# EAGLE design TrinketBlinkM0 (EAGLE 8.4.2)
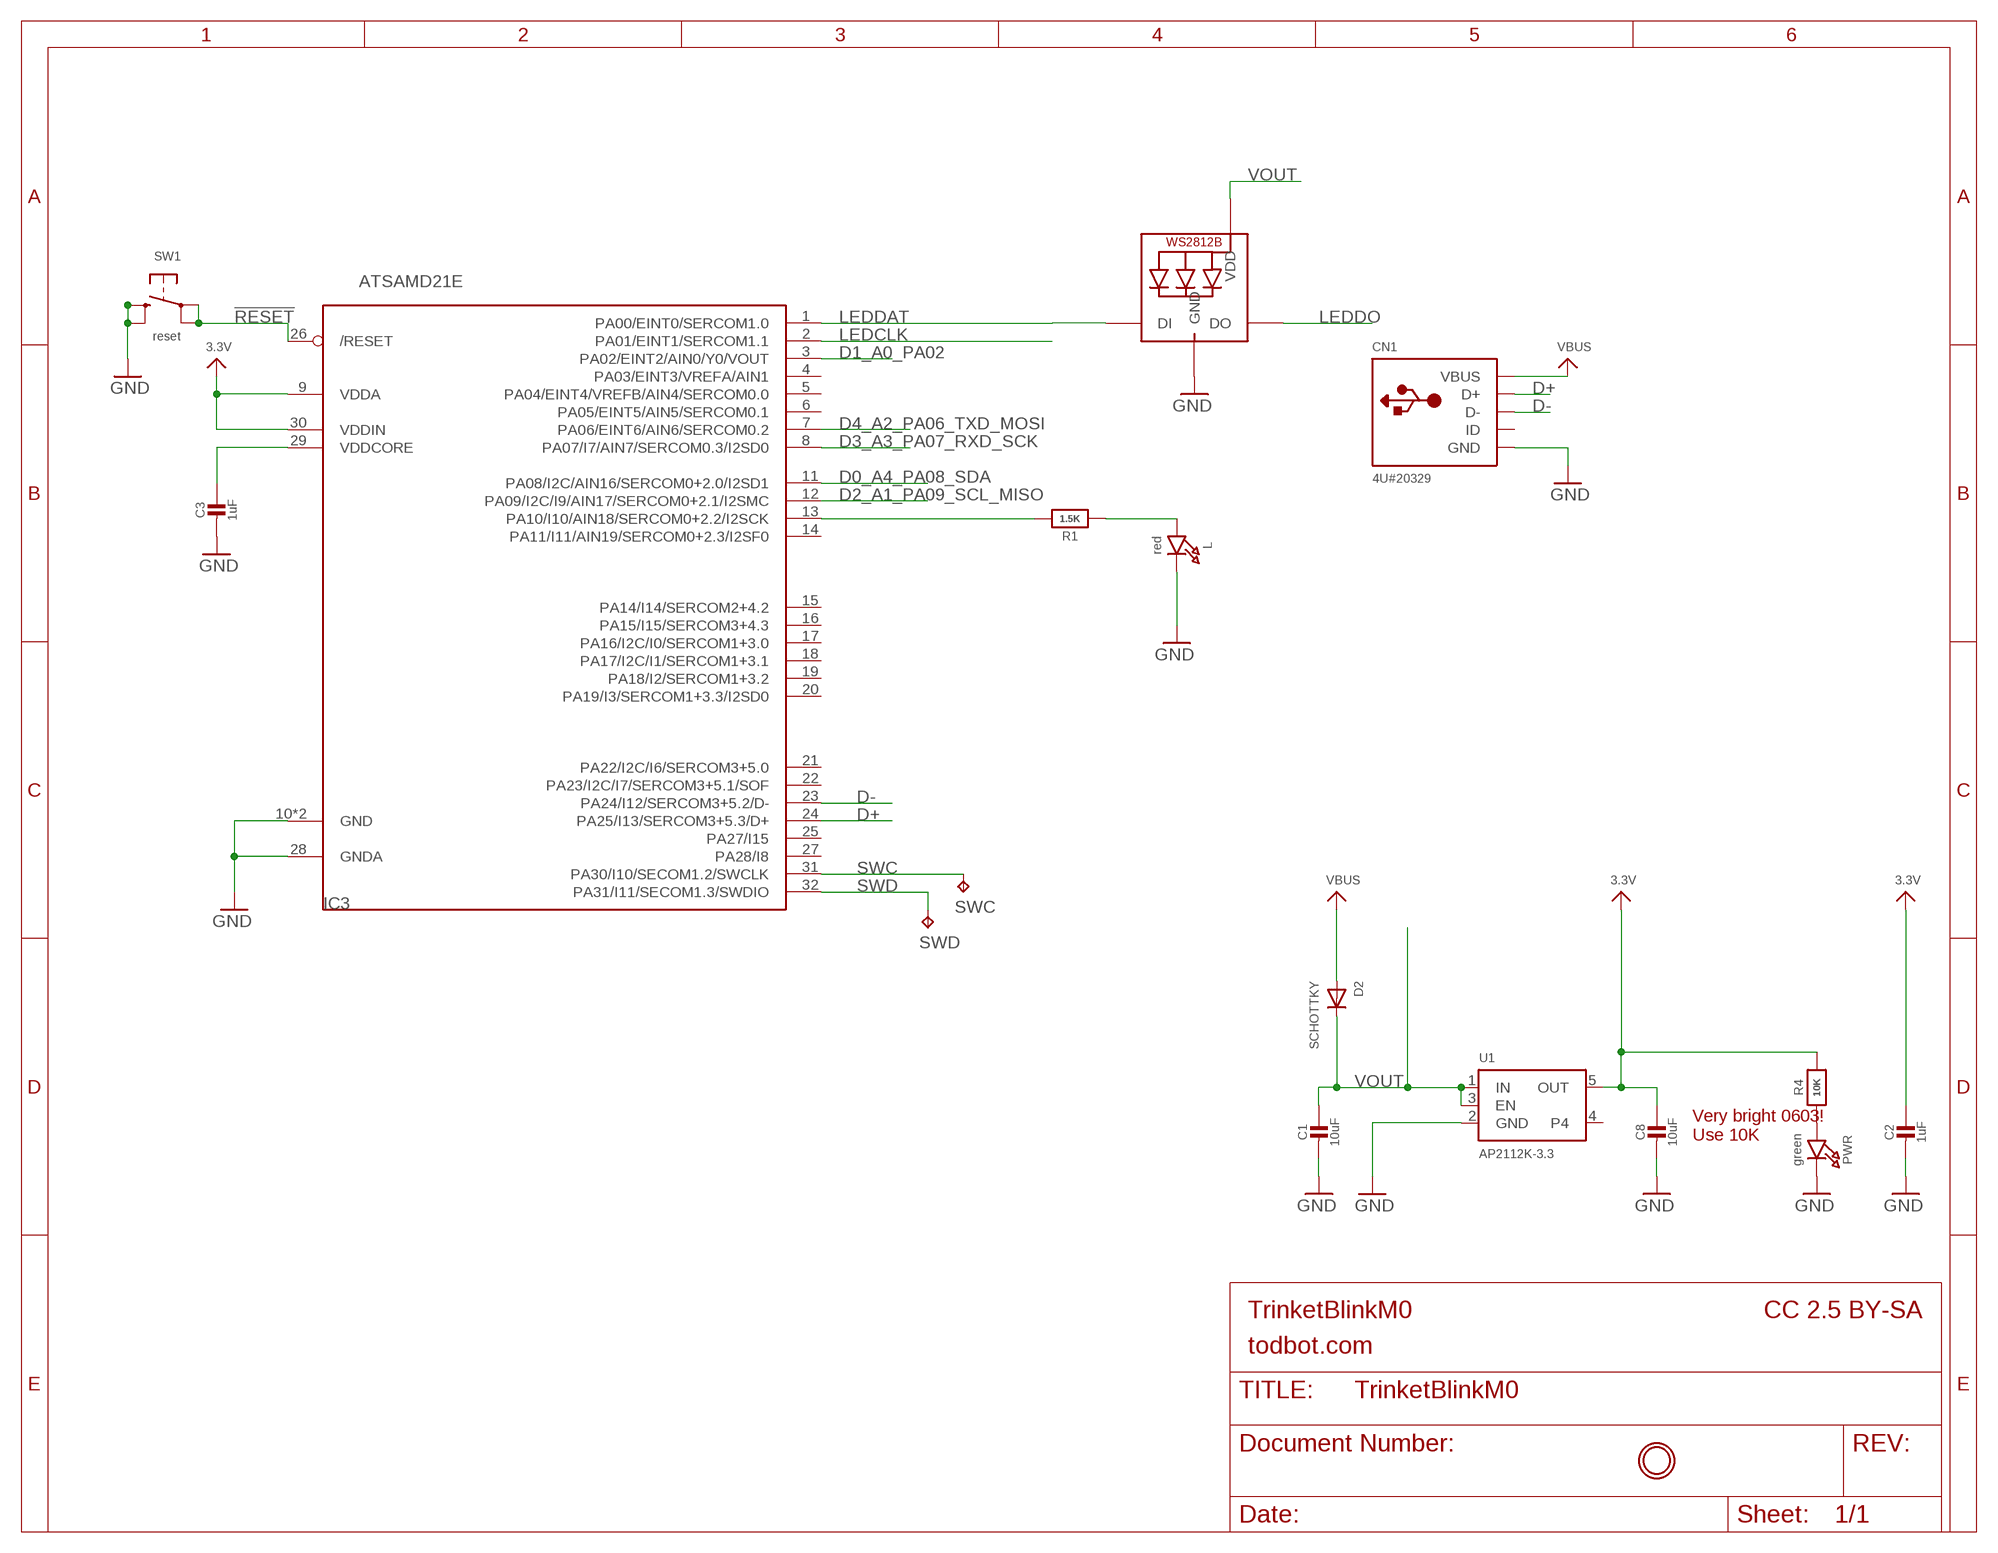
[diagram p0: schematic, sheet 1]

## Parts
C1  10uF  CAP_CERAMIC0805-NOOUTLINE  [0805-NO]
C2  1uF  CAP_CERAMIC0603_NO  [0603-NO]
C3  1uF  CAP_CERAMIC0603_NO  [0603-NO]
C8  10uF  CAP_CERAMIC0805-NOOUTLINE  [0805-NO]
CN1  4U#20329  USB_MICRO_20329_V2  [4UCONN_20329_V2]
D2  SCHOTTKY  DIODE_SOD-123FL  [SOD-123FL]
IC3  ATSAMD21E  [QFN32_5MM]
L  red  LED0603_NOOUTLINE  [CHIPLED_0603_NOOUTLINE]
LED1  WS2812B5050  [WS2812B]
PWR  green  LED0603_NOOUTLINE  [CHIPLED_0603_NOOUTLINE]
R1  1.5K  RESISTOR_0603_NOOUT  [0603-NO]
R4  10K  RESISTOR_0603_NOOUT  [0603-NO]
SW1  reset  SWITCH_TACT_SMT4.6X2.8  [BTN_KMR2_4.6X2.8]
SWC  TPB1,27  [B1,27]
SWD  TPB1,27  [B1,27]
U1  AP2112K-3.3  VREG_SOT23-5  [SOT23-5]
U$8  MOUNTINGHOLE2.0  [MOUNTINGHOLE_2.0_PLATED]

## Nets
3.3V: C2.1 C8.1 IC3.9(VDDA) IC3.30(VDDIN) R4.2 U1.5(OUT)
!RESET: IC3.26(/RESET) SW1.A'(P1) SW1.A(P)
D0_A4_PA08_SDA: IC3.11(PA08/I2C/AIN16/SERCOM0+2.0/I2SD1)
D1_A0_PA02: IC3.3(PA02/EINT2/AIN0/Y0/VOUT)
D2_A1_PA09_SCL_MISO: IC3.12(PA09/I2C/I9/AIN17/SERCOM0+2.1/I2SMC)
D3_A3_PA07_RXD_SCK: IC3.8(PA07/I7/AIN7/SERCOM0.3/I2SD0)
D4_A2_PA06_TXD_MOSI: IC3.7(PA06/EINT6/AIN6/SERCOM0.2)
D+: CN1.D+ IC3.24(PA25/I13/SERCOM3+5.3/D+)
D-: CN1.D- IC3.23(PA24/I12/SERCOM3+5.2/D-)
GND: C1.2 C2.2 C3.2 C8.2 CN1.BASE@1(GND) CN1.BASE@2(GND) CN1.GND CN1.SPRT@1(GND) CN1.SPRT@2(GND) CN1.SPRT@3(GND) CN1.SPRT@4(GND) IC3.10(GND) IC3.28(GNDA) IC3.33(GND) L.C LED1.3-GND(GND) PWR.C SW1.B'(S1) SW1.B(S) U1.2(GND)
LEDCLK: IC3.2(PA01/EINT1/SERCOM1.1)
LEDDAT: IC3.1(PA00/EINT0/SERCOM1.0) LED1.4-DIN(DI)
LEDDO: LED1.2-DOUT(DO)
N$1: L.A R1.1
N$2: IC3.13(PA10/I10/AIN18/SERCOM0+2.2/I2SCK) R1.2
N$6: PWR.A R4.1
SWC: IC3.31(PA30/I10/SECOM1.2/SWCLK) SWC.TP
SWD: IC3.32(PA31/I11/SECOM1.3/SWDIO) SWD.TP
VBUS: CN1.VBUS D2.A
VDDCORE: C3.1 IC3.29(VDDCORE)
VOUT: C1.1 D2.C LED1.1-VDD(VDD) U1.1(IN) U1.3(EN)
Unconnected: CN1.ID IC3.4(PA03/EINT3/VREFA/AIN1) IC3.5(PA04/EINT4/VREFB/AIN4/SERCOM0.0) IC3.6(PA05/EINT5/AIN5/SERCOM0.1) IC3.14(PA11/I11/AIN19/SERCOM0+2.3/I2SF0) IC3.15(PA14/I14/SERCOM2+4.2) IC3.16(PA15/I15/SERCOM3+4.3) IC3.17(PA16/I2C/I0/SERCOM1+3.0) IC3.18(PA17/I2C/I1/SERCOM1+3.1) IC3.19(PA18/I2/SERCOM1+3.2) IC3.20(PA19/I3/SERCOM1+3.3/I2SD0) IC3.21(PA22/I2C/I6/SERCOM3+5.0) IC3.22(PA23/I2C/I7/SERCOM3+5.1/SOF) IC3.25(PA27/I15) IC3.27(PA28/I8) U1.4

## Notes on the sheet
- Very bright 0603!
  Use 10K
- TrinketBlinkM0 | CC 2.5 BY-SA
- todbot.com

## Library data of the parts
C1-C3 C8 = microbuilder:CAP_CERAMIC: Ceramic Capacitors For new designs, use the packages preceded by an '_' character since they are more reliable: The following footprints should be used on most boards: _0402 - Standard footprint for regular board layouts _0603 - Standard footprint for regular board layouts _0805 - Standard footprint for regular board layouts _1206 - Standard footprint for regular board layouts For extremely tight-pitch boards where space is at a premium, the following 'micro-pitch' footprints can be used (smaller pads, no silkscreen outline, etc.): _0402MP - Micro-pitch footprint for very dense/compact boards _0603MP - Micro-pitch footprint for very dense/compact boards _0805MP - Micro-pitch footprint for very dense/compact boards _1206MP - Micro-pitch footprint for very dense/compact boards
CN1 = microbuilder:USB: USB Connectors USBMINIB - Surface Mount Female Mini-B USB Connector 4UConnector: 06564
D2 = adafruit:DIODE: Diode SMADIODE - SMA Surface Mount Package 20V 1A Schottky Diode Digikey: 641-1014-6-ND DO-1N4148 - Through Hole Small Current Diode SOD-123 20V 1 A (.5mV Vf) Schottky Diode - Digikey: MBRX120TPMSCT-ND SOD-323 10V 570mA (.38mV Vf, 3ns) Schottky Diode - Digikey: ZLLS410CT-ND SOD-523 30V 30mA Schottky Diode (RB751S-40TE61) - Digikey: RB751S-40TE61CT-ND SOT23-R/W - SOT23 Package (R = Solder Paste/Reflow Ovens, W = Hand-Soldering) BAT54Film 40V 300mA - Digikey: 497-7162-1-ND
IC3 = microbuilder:ATSAMD21E
L PWR = microbuilder:LED: LED 0603 - 0603 Surface Mount Package 2mA: Green LED - Low Power (3.9mcd, 2ma, 1.7Vf) - Digikey: 475-2709-2-ND Orange LED - Low Power (9.8mcd, 2ma, 1.8Vf) - Digikey: 475-1194-2-ND Red LED - Low Power (5mcd, 2ma, 1.8Vf) - Digikey: 475-1195-2-ND Yellow LED - Low Power (7mcd, 2ma, 1.8Vf) - Digikey: 475-1196-2-ND 5mA: Blue LED - Low Power (17mcd, 5ma, 2.9Vf) - Digikey: LNJ937W8CRACT-ND 0805 - 0805 Surface Mount Package 2mA: Red LED (8.8mcd, 2mA, 1.8Vf, Clear) - Low Power [Digikey: 475-2510-1-ND] Green LED (5mcd, 2mA, 1.8Vf, Clear) - Low Power [Digikey: 475-2730-1-ND] Yellow LED (11.3mcd, 2mA, 1.8Vf, Clear) - Low Power [Digikey: 475-2555-1-ND] 20mA: Red LED (104mcd, 20mA, Diffused) - LS R976 [Digikey: 475-1278-6-ND] Red LED (12mcd, 20mA, 2.0Vf, Clear) - APT2012EC [Digikey: 754-1128-1-ND] Green LED (15mcd, 20mA, 2.2Vf, Clear) - APT2012GC [Digikey: 754-1131-1-ND] Orange LED (160mcd, 20mA, 2.1Vf, Clear) - APT2012SECK [Digikey: 754-1130-1-ND] 1206 - 1206 Surface Mount Package Green LED (26mcd, 20mA, Diffused) - LG N971 [Digikey: 475-1407-6-ND] Red LED (15mcd, 20mA, Diffused) - LH N974 [Digikey: 475-1416-6-ND] Cree - Cree High-Power Surface Mount LEDs XPEBWT-L1-0000-00D50 - White 111lm 350mA 2.9Vf 6200K 110° XTEAWT-00-0000-00000LEE3 - White 114lm 350mA 2.85Vf 5000K 115° Everlight - Everlight 45-21 Series Surface Mount LEDs 45-21/QK2C-B2832AC2CB2/2T - Warm White 2000mcd 20mA 3.25Vf 3050K 120° 45-21/LK2C-B38452C4CB2/2T - Nuetral White 2000mcd 20mA 3.25Vf 4150K 120° 45-21/LK2C-B50634C6CB2/2T - Cold White 2200mcd 20mA 3.25Vf 5650K 120° PLCC2 Reverse Mount LS T77K-J1L2-1-0-2-R18-Z - Red 11.25mcd 2mA 1.8Vf 630nm 120° LO T77K-L1M2-24-Z - Orange 19.6mcd 2mA 1.8Vf 606nm 120° LY T77K-K2M1-26-Z - Yellow 15.7mcd 2mA 1.8Vf 587nm 120°
LED1 = adafruit:WS2812B
R1 R4 = microbuilder:RESISTOR: Resistors For new designs, use the packages preceded by an '_' character since they are more reliable: The following footprints should be used on most boards: _0402 - Standard footprint for regular board layouts _0603 - Standard footprint for regular board layouts _0805 - Standard footprint for regular board layouts _1206 - Standard footprint for regular board layouts For extremely tight-pitch boards where space is at a premium, the following 'micro-pitch' footprints can be used (smaller pads, no silkscreen outline, etc.): _0402MP - Micro-pitch footprint for very dense/compact boards _0603MP - Micro-pitch footprint for very dense/compact boards _0805MP - Micro-pitch footprint for very dense/compact boards _1206MP - Micro-pitch footprint for very dense/compact boards
SW1 = microbuilder:SWITCH_TACT_SMT: SMT Tact Switches 6x6mm - Digikey: P12940SCT-ND KMR2 (4.6x2.8mm) - Digikey: 401-1426-1-ND EVQ-PQHB55 - Light Touch, 160GF (4.5x4.5mm) - Digikey: P8090SCT-ND KMT0 - KMT021 NGJ LHS (etc.) IP68/Waterproof - Digikey: CKN10289CT-ND
SWC SWD = testpad:TP: Test pad
U1 = microbuilder:VREG_SOT23-5: SOT23-5 Fixed Voltage Regulators Part Current Out V Out V In V Dropout θJA (°C/W) TJ (°C) Digikey Part No. ADP121 150mA 3.3V 3.4-5.5V 0.09V @ 150mA -- -- ADP121-AUJZ33R7CT-ND ADP121 150mA 3.0V 3.1-5.5V 0.09V @ 150mA -- -- ADP121-AUJZ30R7CT-ND ADP122 300mA 3.3V 3.4-5.5V 0.085V @ 300mA -- -- ADP122AUJZ-3.3-R7CT-ND ADP1712 300mA 3.3V 3.5-5.5V 0.17V @ 300mA -- -- ADP1712AUJZ-3.3-R7TR-ND AP7311 (Low Cost) 150mA 3.3V 3.5-6V 0.15V @ 150mA -- -- AP7311-33WG-7DICT-ND LD39015M18R 150mA 1.8V 1.9V-5.5V 0.08V @ 100mA -- -- 497-6977-1-ND LP2985A-33DBVR 150mA 3.3V 3.3-16V 0.28V @ 150mA 206 150 296-18479-1-ND MCP1824T-3302E/OT 300mA 3.3V 3.5V-6V 0.2V @ 300mA -- -- MCP1824T-3302E/OTCT-ND MIC5205-2.5YM5 TR 150mA 2.5V 2.7-16V 0.165V @ 150mA -- -- 576-1257-2-ND MIC5205-3.0YM5 TR 150mA 3.0V 3.2V-16V 0.165V @ 150mA -- -- 576-1258-2-ND MIC5205-3.3YM5 TR 150mA 3.3V 3.5V-16V 0.165V @ 150mA -- -- 576-1259-2-ND TPS780330220 150mA 3.3V+2.2V 3.6-5.5V 250mV Max -- -- 296-23332-1-ND TDA3663/N1,135 100mA 3.3V 3.5-45V 0.18V @ 50mA -- -- 568-5343-1-ND Max operating temp can be calculated using θJA, TJ (max junction temperature), and power in watts. Set the "Maximum Ambient Temperature" until it reaches TJ ("Max Junction Temperature"), which is the absolute limit for safe use of the regulator: Heat Sink Temperature Calculator <http://www.daycounter.com/Calculators/Heat-Sink-Temperature-Calculator.phtml> For example, With 12V source into a 3.3V LP2985 and a 30mA load, we are dissipating (12V-3.3V) * 0.03A = 0.261W. With a θJA of 206 °C/W, a TJ of 150°C, and 261mW we can safely use the chip without a heat sink up to 75°C (=147.1°C Junction Temperature).
U$8 = microbuilder:MOUNTINGHOLE: Mounting Hole For #2 screws (0.086"/2.18mm width, 0.094"/2.4mm hole) use 2.5mm; BOM: EXCLUDE

## Net classes
1 power: width 0.305 mm

## Board
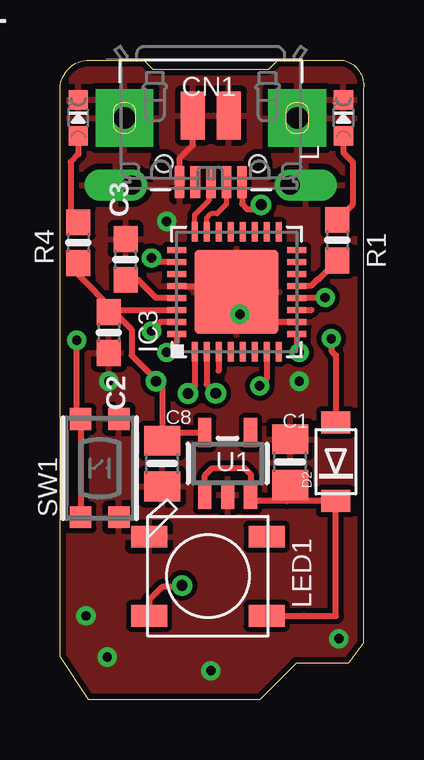
[diagram p1: board, top side]
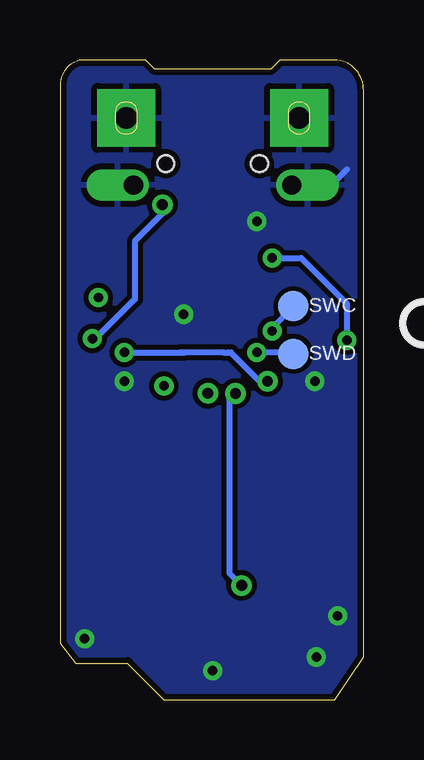
[diagram p2: board, bottom side, seen from below]

Size 12.65 x 26.67 mm. Coordinates in mm from the lower left corner, seen from the top.
Outline: 12.64,25.46 12.64,2.35 12,1.52 9.84,1.52 8.32,0 1.21,0 0,1.78 0,25.4 arc-90 1.21,26.67 3.49,26.67 3.87,26.29 8.7,26.29 9.08,26.67 11.75,26.67 arc-90 12.64,25.46
Copper layers (1*16): Top 0.035mm / dielectric 1.5mm / Bottom 0.035mm
Design rules "adafruit *": minimum track width 8mil, minimum drill 15.5mil, track to track 8mil, track to pad 8mil, pad to pad 8mil, via to via 8mil, smd to smd 8mil, copper to edge 10mil, drill to drill 8mil, minimum pad ring 10mil, minimum via ring 8mil, stop-mask expansion 2mil, vias tented up to drill 20mil, thermal gap 10mil

### Footprints (pad centres in the part's own frame; a part is rotated, then mirrored left to right if it is on the bottom)
0805-NO = smd 1.24 x 1.5: 1 -0.95,0; 2 0.95,0
0603-NO = smd 1.075 x 1: 1 -0.85,0; 2 0.85,0
4UCONN_20329_V2 = smd 1 x 2: BASE@1 -0.75,-2; BASE@2 0.75,-2 | smd 0.4 x 1.35: D+ 0,0.775; D- -0.65,0.775; GND 1.3,0.775; ID 0.65,0.775; VBUS -1.3,0.775 | drill 0.8 pad 1.143 offset: SPRT@1 -3.3,0.9; SPRT@2 3.3,0.9 | drill 0.9 pad 2.413 square: SPRT@3 -3.6,-1.9; SPRT@4 3.6,-1.9 | hole 0.7: -1.95,0; 1.95,0
SOD-123FL = smd 0.91 x 1.22: A 1.637,0; C -1.637,0
QFN32_5MM = smd 0.8 x 0.25: 1 -2.5,1.75; 2 -2.5,1.25; 3 -2.5,0.75; 4 -2.5,0.25; 5 -2.5,-0.25; 6 -2.5,-0.75; 7 -2.5,-1.25; 8 -2.5,-1.75; 17 2.5,-1.75; 18 2.5,-1.25; 19 2.5,-0.75; 20 2.5,-0.25; 21 2.5,0.25; 22 2.5,0.75; 23 2.5,1.25; 24 2.5,1.75 | smd 0.25 x 0.8: 9 -1.75,-2.5; 10 -1.25,-2.5; 11 -0.75,-2.5; 12 -0.25,-2.5; 13 0.25,-2.5; 14 0.75,-2.5; 15 1.25,-2.5; 16 1.75,-2.5; 25 1.75,2.5; 26 1.25,2.5; 27 0.75,2.5; 28 0.25,2.5; 29 -0.25,2.5; 30 -0.75,2.5; 31 -1.25,2.5; 32 -1.75,2.5 | smd 3.5 x 3.5: 33 0,0
CHIPLED_0603_NOOUTLINE = smd 0.8 x 0.8: A 0,-0.75; C 0,0.75
WS2812B = smd 1.5 x 0.9: 1-VDD 2.45,-1.65; 2-DOUT 2.45,1.65; 3-GND -2.45,1.65; 4-DIN -2.45,-1.65
BTN_KMR2_4.6X2.8 = smd 0.9 x 0.9: A 2.05,0.8; A' -2.05,0.8; B 2.05,-0.8; B' -2.05,-0.8
B1,27 = smd 1.27 x 1.27: TP 0,0
SOT23-5 = smd 0.55 x 1.2: 1 -0.95,-1.3; 2 0,-1.3; 3 0.95,-1.3; 4 0.95,1.3; 5 -0.95,1.3
MOUNTINGHOLE_2.0_PLATED = drill 2.2 pad 3: P$1 0,0

### Placement (x,y rotation side)
C1  9.59,9.91 90 top
C2  2.03,15.3 270 top
C3  2.73,18.35 90 top
C8  4.25,9.84 270 top
CN1  6.29,22.35 180 top
D2  11.49,9.92 90 top
IC3  7.36,17 90 top
L  11.81,24.26 0 top
LED1  6.16,5.14 0 top
PWR  0.76,24.26 0 top
R1  11.56,19.15 270 top
R4  0.76,19.05 270 top
SW1  1.66,9.65 90 top
SWC  2.92,16.41 0 bottom
SWD  2.92,14.41 0 bottom
U1  6.99,9.84 0 top
U$1  [TRINKET_M0_BOTTOM]  13.91,0 0 bottom
U$8  -7.75,6.73 0 top  (outside the outline)
U$12  [PCBFEAT-REV-040]  -2.54,15.68 90 bottom
U$20  [TRINKET_M0_TOP]  -1.33,0 0 top

### Tracks (layer width: path | path; a pad name or v marks a point on that pad's centre or on a via)
3.3V  (via drill 0.39, 0.45)
  Top 0.254: IC3.9 9.86,14.59 v9.97,14.48 | R4.2 0.76,17.72 2.23,16.25 | 4,11.14 3.91,11.14 | 4,11.14 U1.5 | 2.23,16.25 IC3.30 | 2.23,16.25 2.13,16.25 C2.1 2.26,16.15 2.98,15.43 2.98,14.35 4,13.34 v4,13.27 4.25,13.02 C8.1 4.25,10.89 4,11.14
  Bottom 0.254: v9.97,14.48 7.62,14.48 | 7.62,14.48 7.43,14.48 | 5.84,14.48 7.62,14.48 | 5.84,14.48 5.65,14.48 | 5.84,14.48 5.52,14.48 4.32,13.27 v4,13.27
!RESET  (via drill 0.39)
  Top 0.254: IC3.26 3.91,18.25 arc-90 v3.81,18.41 | 0.85,11.81 0.86,11.81 0.86,11.68 | v0.7,14.99 0.7,11.86 SW1.A 0.86,11.68 | 0.86,11.68 SW1.A'
  Bottom 0.254: 3.43,18.41 v3.81,18.41 2.6,18.41 0.7,16.51 v0.7,14.99
D0_A4_PA08_SDA
  Top 0.254: IC3.11 10.48,16.25
D1_A0_PA02
  Top 0.254: IC3.3 6.61,13.71
D2_A1_PA09_SCL_MISO  (via drill 0.39)
  Top 0.254: v11.05,16.76 11.11,16.76 11.12,16.75 IC3.12
D4_A2_PA06_TXD_MOSI  (via drill 0.39)
  Top 0.254: v8.32,13.08 8.61,13.37 IC3.7
D+
  Top 0.203: IC3.24 5.61,20.21 6.22,20.83 6.22,21.51
  Top 0.254: 6.22,21.51 CN1.D+
D-
  Top 0.203: CN1.D- 6.94,20.65 6.54,20.26 6.29,20.26 6.11,20.08 IC3.23
GND  (via drill 0.39)
  Top 0.254: v7.49,16.07 7.36,16.2 IC3.33 arc90 7.11,17.25 IC3.28 | 7.49,15.88 v7.49,16.07 | CN1.GND 4.99,22.58 5.54,23.13 CN1.BASE@2 | IC3.10 7.81,15.75 arc-90 v7.49,16.07 | 1.94,23.51 CN1.SPRT@4
  Bottom 0.254: CN1.SPRT@2 1.34,21.45 0.7,22.1
  other vias: 1.97,1.78 1.08,3.49 11.62,2.54 6.29,1.21 2.03,13.27 4.45,19.94 9.97,13.27
  pour Bottom: -1.33,26.67 -1.33,0 13.91,0 13.91,26.67
  pour Top: -1.78,26.86 -1.78,0.19 14.73,0.06 14.73,26.73
LEDCLK  (via drill 0.45)
  Top 0.254: IC3.2 6.11,13.16 v6.49,12.78
LEDDAT  (via drill 0.45)
  Top 0.254: v5.33,12.76 5.61,13.04 IC3.1 | v5.08,4.76 5.02,4.7 4.25,4.7 3.71,4.15 LED1.4-DIN
  Bottom 0.254: v5.33,12.76 5.59,12.51 5.59,5.27 v5.08,4.76
N$1
  Top 0.254: L.A 11.81,22.8 12.19,22.41 12.19,20.64 R1.1
N$2
  Top 0.254: IC3.13 10.46,17.25 10.73,17.53 10.78,17.53 R1.2
N$6
  Top 0.254: PWR.A 0.76,22.73 0.44,22.41 0.44,20.22 R4.1
SWC  (via drill 0.39)
  Top 0.254: IC3.31 4.2,15.75 v3.81,15.37
  Bottom 0.254: SWC.TP 2.92,16.38 3.81,15.49 3.81,15.46 v3.81,15.37
SWD  (via drill 0.39)
  Top 0.254: IC3.32 4.86,14.89 v4.45,14.48
  Bottom 0.254: SWD.TP 2.98,14.48 v4.45,14.48
VBUS  (via drill 0.39, 0.45)
  Top 0.254: CN1.VBUS 7.59,20.67 7.81,20.45 8.19,20.45 v8.38,20.64 | v11.3,15.05 11.3,14.54 11.49,14.35 D2.A
  Bottom 0.254: v8.38,20.64 8.38,20.26 9.53,19.11 9.53,16.7 11.18,15.05 v11.3,15.05
VDDCORE
  Top 0.254: IC3.29 4.01,16.75 3.26,17.5 C3.1
VOUT
  Top 0.254: 7.87,8.54 U1.3 7.94,9.4 7.68,9.65 6.35,9.65 6.03,9.34 U1.1 | 7.87,8.54 U1.3 | 9.46,8.83 9.46,8.54 | LED1.1-VDD 10.16,3.49 11.49,3.49 D2.C 9.46,8.28 | 9.46,8.28 9.46,8.83 | 9.46,8.28 7.87,8.28 7.87,8.54 | C1.1 9.46,8.83